# EAGLE schematic projekt_robotek (EAGLE 9.6.2)
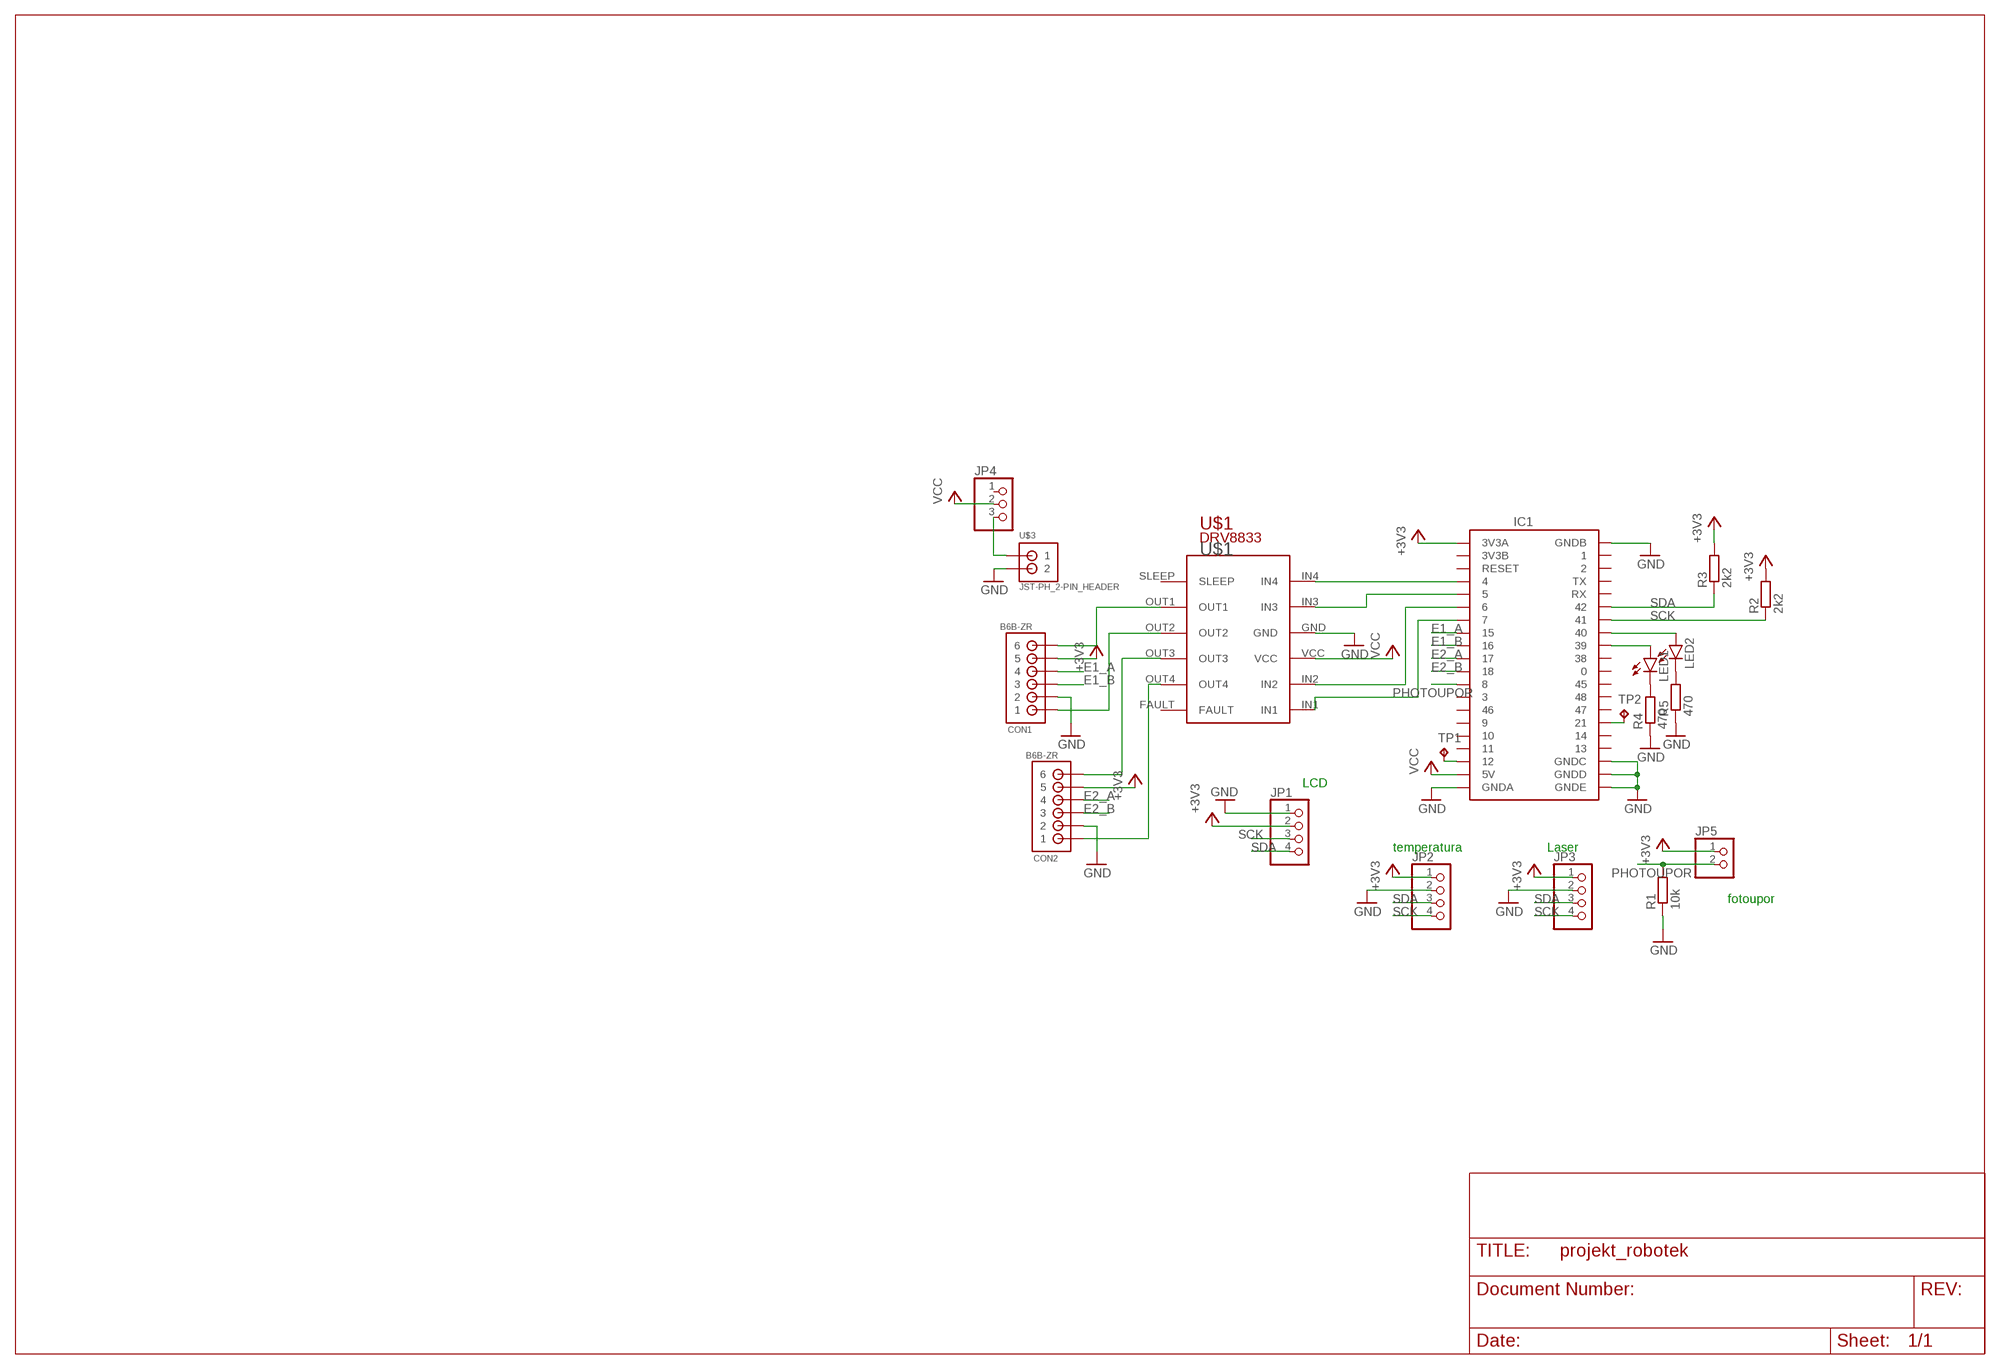
[diagram p0: schematic, sheet 1]

## Parts
CON1  B6B-ZR  [B6B-ZR]
CON2  B6B-ZR  [B6B-ZR]
IC1  ESP32_S3  [SSFD_LOLIN32_WEMOS_CHINA_W_BATT]
JP1  PINHD-1X4  [1X04]
JP2  PINHD-1X4  [1X04]
JP3  PINHD-1X4  [1X04]
JP4  PINHD-1X3  [1X03]
JP5  PINHD-1X2  [1X02]
LED1  LEDSML0805  [SML0805]
LED2  LEDSML0805  [SML0805]
R1  10k  R-EU_R1210  [R1210]
R2  2k2  R-EU_R0805  [R0805]
R3  2k2  R-EU_R0805  [R0805]
R4  470  R-EU_R1210  [R1210]
R5  470  R-EU_R1210  [R1210]
TP1  TPTP20R  [TP20R]
TP2  TPTP20R  [TP20R]
U$1  POLOLU-DRV8833  [POLOLU-DRV8833]
U$3  JST-PH_2-PIN_HEADER  [JST_B2B-PH_HEADER]

## Nets
+3V3: CON1.5 CON2.5 IC1.3V3A JP1.2 JP5.1 R2.2 R3.2
E1_A: CON1.4 IC1.15
E1_B: CON1.3 IC1.16
E2_A: CON2.4 IC1.17
E2_B: CON2.3 IC1.18
GND: CON1.2 CON2.2 IC1.GNDA4(GNDA) IC1.GNDB IC1.GNDC1(GNDC) IC1.GNDD1(GNDD) IC1.GNDE JP1.1 JP2.2 JP3.2 R1.1 R4.1 R5.1 U$1.GND U$3.P2
N$1: IC1.4 U$1.IN4
N$2: IC1.5 U$1.IN3
N$3: IC1.6 U$1.IN2
N$4: IC1.7 U$1.IN1
N$5: CON1.1 U$1.OUT2
N$6: CON1.6 U$1.OUT1
N$7: CON2.6 U$1.OUT3
N$8: CON2.1 U$1.OUT4
N$9: JP4.3 U$3.P1
N$10: LED1.C R4.2
N$11: JP2.1 JP3.1 ; supply symbol labelled +3V3
N$12: LED2.C R5.2
N$13: IC1.39 LED1.A
N$14: IC1.40 LED2.A
N$15: IC1.12 TP1.TP
N$16: IC1.21 TP2.TP
PHOTOUPOR: IC1.8 JP5.2 R1.2
SCK: IC1.41 JP1.3 JP2.4 JP3.4 R2.1
SDA: IC1.42 JP1.4 JP2.3 JP3.3 R3.1
VCC: IC1.5V JP4.2 U$1.VCC
Unconnected: IC1.0 IC1.1 IC1.2 IC1.3 IC1.3V3D1(3V3B) IC1.9 IC1.10 IC1.11 IC1.13 IC1.14 IC1.38 IC1.45 IC1.46 IC1.47 IC1.48 IC1.RESET IC1.RX IC1.TX JP4.1 U$1.FAULT U$1.SLEEP

## Notes on the sheet
- LCD
- temperatura | Laser
- fotoupor

## Library data of the parts
CON1 CON2 = jst:B6B-ZR: JST-ZH Connector 6 pol, 1.5mm pitch Package: B6B-ZR Source: http://www.jst-mfg.com/product/pdf/eng/eZH.pdf
IC1 = ESP32_S3_v1:ESP32_S3: BY SEGASONICFAN DESIGNS HTTP://WWW.SEGASONICFAN.WIXSITE.COM/RETRO WEMOS ESP32 BREAKOUT 4MB CHINA WITH BATTERY CONNECTOR https://arduino-projekte.info/wemos-lolin32/ https://diyprojects.io/wemos-lolin32-new-development-board-esp32-e645-4mb-memory-lipo-battery-connector/
JP1-JP3 = pinhead:PINHD-1X4: PIN HEADER
JP4 = pinhead:PINHD-1X3: PIN HEADER
JP5 = pinhead:PINHD-1X2: PIN HEADER
LED1 LED2 = led:LED: LED OSRAM: - CHIPLED LG R971, LG N971, LY N971, LG Q971, LY Q971, LO R971, LY R971 LH N974, LH R974 LS Q976, LO Q976, LY Q976 LO Q996 - Hyper CHIPLED LW Q18S LB Q993, LB Q99A, LB R99A - SideLED LS A670, LO A670, LY A670, LG A670, LP A670 LB A673, LV A673, LT A673, LW A673 LH A674 LY A675 LS A676, LA A676, LO A676, LY A676, LW A676 LS A679, LY A679, LG A679 - Hyper Micro SIDELED® LS Y876, LA Y876, LO Y876, LY Y876 LT Y87S - SmartLED LW L88C, LW L88S LB L89C, LB L89S, LG L890 LS L89K, LO L89K, LY L89K LS L896, LA L896, LO L896, LY L896 - TOPLED LS T670, LO T670, LY T670, LG T670, LP T670 LSG T670, LSP T670, LSY T670, LOP T670, LYG T670 LG T671, LOG T671, LSG T671 LB T673, LV T673, LT T673, LW T673 LH T674 LS T676, LA T676, LO T676, LY T676, LB T676, LH T676, LSB T676, LW T676 LB T67C, LV T67C, LT T67C, LS T67K, LO T67K, LY T67K, LW E67C LS E67B, LA E67B, LO E67B, LY E67B, LB E67C, LV E67C, LT E67C LW T67C LS T679, LY T679, LG T679 LS T770, LO T770, LY T770, LG T770, LP T770 LB T773, LV T773, LT T773, LW T773 LH T774 LS E675, LA E675, LY E675, LS T675 LS T776, LA T776, LO T776, LY T776, LB T776 LHGB T686 LT T68C, LB T68C - Hyper Mini TOPLED® LB M676 - Mini TOPLED Santana® LG M470 LS M47K, LO M47K, LY M47K Source: http://www.osram.convergy.de LUXEON: - LUMILED® LXK2-PW12-R00, LXK2-PW12-S00, LXK2-PW14-U00, LXK2-PW14-V00 LXK2-PM12-R00, LXK2-PM12-S00, LXK2-PM14-U00 LXK2-PE12-Q00, LXK2-PE12-R00, LXK2-PE12-S00, LXK2-PE14-T00, LXK2-PE14-U00 LXK2-PB12-K00, LXK2-PB12-L00, LXK2-PB12-M00, LXK2-PB14-N00, LXK2-PB14-P00, LXK2-PB14-Q00 LXK2-PR12-L00, LXK2-PR12-M00, LXK2-PR14-Q00, LXK2-PR14-R00 LXK2-PD12-Q00, LXK2-PD12-R00, LXK2-PD12-S00 LXK2-PH12-R00, LXK2-PH12-S00 LXK2-PL12-P00, LXK2-PL12-Q00, LXK2-PL12-R00 Source: www.luxeon.com KINGBRIGHT: KA-3528ASYC Source: www.kingbright.com
R1-R5 = rcl:R-EU_: RESISTOR, European symbol; SPICEPREFIX: R
TP1 TP2 = testpad:TP: Test pad
U$1 = Pololu_Driver_DRV8833:POLOLU-DRV8833: Created by: Deltarios DRV8833 pololu dual drive controller, PCB-ready device
U$3 = srg:JST-PH_2-PIN_HEADER: 2-pin JST PH Shrouded Header, top entry P/N B2B-PH-K-S Mating connector PHR-2 Mating cable assembly: Sparkfun PRT-09914 <http://www.sparkfun.com/products/9914>